# Altium schematic sheet Power.SchDoc: Linefollower-Power
size A3; Author: Patryk Bujak; DrawnBy: Patryk Bujak; DocumentNumber: 12; Revision: 1.0; SheetNumber: 10; SheetTotal: 10
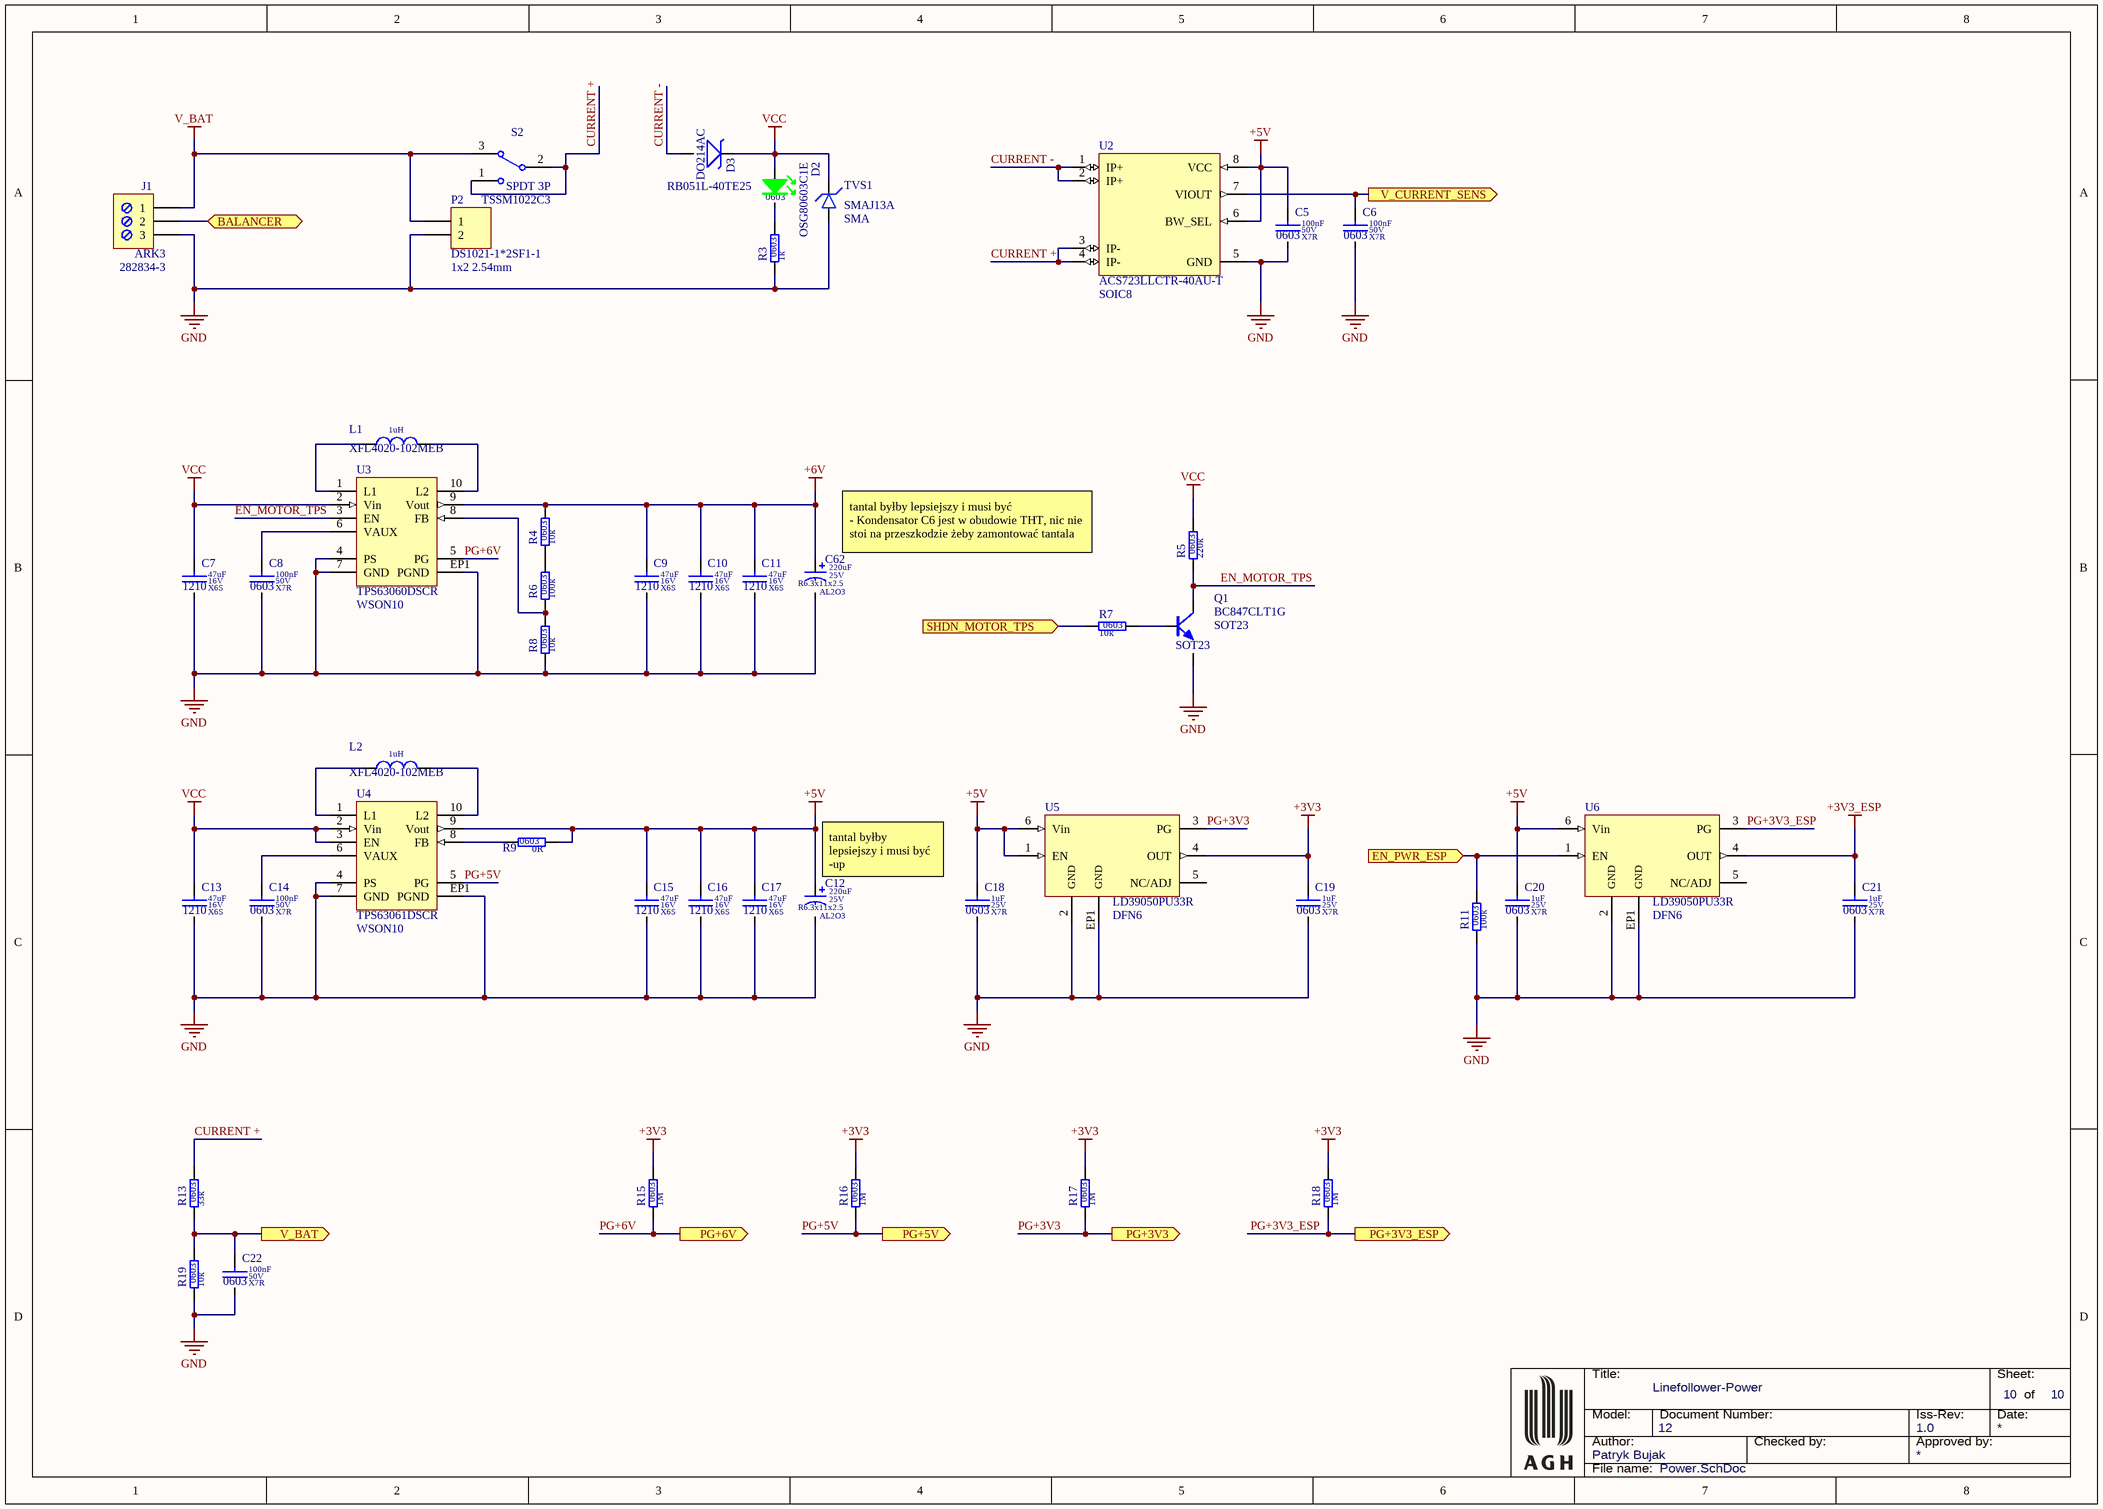
[diagram p0: Power.SchDoc]

## Parts
C5  value 100nF  Dielectric: X7R  Voltage: 50V  SCH_Footprint: 0603  [C_0603_1608]  (hidden comment: Ceramic X7R)
C6  value 100nF  Dielectric: X7R  Voltage: 50V  SCH_Footprint: 0603  [C_0603_1608]  (hidden comment: Ceramic X7R)
C7  value 47uF  Dielectric: X6S  Voltage: 16V  SCH_Footprint: 1210  [C_1210_3225]  (hidden comment: Ceramic X6S)
C8  value 100nF  Dielectric: X7R  Voltage: 50V  SCH_Footprint: 0603  [C_0603_1608]  (hidden comment: Ceramic X7R)
C9  value 47uF  Dielectric: X6S  Voltage: 16V  SCH_Footprint: 1210  [C_1210_3225]  (hidden comment: Ceramic X6S)
C10  value 47uF  Dielectric: X6S  Voltage: 16V  SCH_Footprint: 1210  [C_1210_3225]  (hidden comment: Ceramic X6S)
C11  value 47uF  Dielectric: X6S  Voltage: 16V  SCH_Footprint: 1210  [C_1210_3225]  (hidden comment: Ceramic X6S)
C12  value 220uF  Dielectric: AL2O3  SCH_Footprint: R6.3x11x2.5  Voltage: 25V  [C_R6.3x11x2.5]  (hidden comment: Electrolytic Capacitor)
C13  value 47uF  Dielectric: X6S  Voltage: 16V  SCH_Footprint: 1210  [C_1210_3225]  (hidden comment: Ceramic X6S)
C14  value 100nF  Dielectric: X7R  Voltage: 50V  SCH_Footprint: 0603  [C_0603_1608]  (hidden comment: Ceramic X7R)
C15  value 47uF  Dielectric: X6S  Voltage: 16V  SCH_Footprint: 1210  [C_1210_3225]  (hidden comment: Ceramic X6S)
C16  value 47uF  Dielectric: X6S  Voltage: 16V  SCH_Footprint: 1210  [C_1210_3225]  (hidden comment: Ceramic X6S)
C17  value 47uF  Dielectric: X6S  Voltage: 16V  SCH_Footprint: 1210  [C_1210_3225]  (hidden comment: Ceramic X6S)
C18  value 1uF  Dielectric: X7R  Voltage: 25V  SCH_Footprint: 0603  [C_0603_1608]  (hidden comment: Ceramic X7R)
C19  value 1uF  Dielectric: X7R  Voltage: 25V  SCH_Footprint: 0603  [C_0603_1608]  (hidden comment: Ceramic X7R)
C20  value 1uF  Dielectric: X7R  Voltage: 25V  SCH_Footprint: 0603  [C_0603_1608]  (hidden comment: Ceramic X7R)
C21  value 1uF  Dielectric: X7R  Voltage: 25V  SCH_Footprint: 0603  [C_0603_1608]  (hidden comment: Ceramic X7R)
C22  value 100nF  Dielectric: X7R  Voltage: 50V  SCH_Footprint: 0603  [C_0603_1608]  (hidden comment: Ceramic X7R)
C62  value 220uF  Dielectric: AL2O3  SCH_Footprint: R6.3x11x2.5  Voltage: 25V  [C_R6.3x11x2.5]  (hidden comment: Electrolytic Capacitor)
D2  value OSG80603C1E  SCH_Footprint: 0603  [OL_0603_1608]  (hidden comment: Green led)
D3  SCH_Footprint: DO214AC  [SMA_DO-214AC]  (hidden comment: RB051L-40TE25)
J1  value 282834-3  [J_ARK3_2.54]  (hidden comment: ARK3)
L1  value 1uH  SCH_Footprint: XFL4020-102MEB  [XFL4020]  (hidden comment: Inductor)
L2  value 1uH  SCH_Footprint: XFL4020-102MEB  [XFL4020]  (hidden comment: Inductor)
P2  value DS1021-1*2SF1-1  SCH_Footprint: 1x2 2.54mm  [P_HEADER_1x2_2.54]  (hidden comment: Goldpin)
Q1  value BC847CLT1G  SCH_Footprint: SOT23  [SOT23_TO236_SC59]  (hidden comment: BC847C)
R3  value 1k  SCH_Footprint: 0603  [R_0603_1608]  (hidden comment: Resistor)
R4  value 10k  SCH_Footprint: 0603  [R_0603_1608]  (hidden comment: Resistor)
R5  value 220k  SCH_Footprint: 0603  [R_0603_1608]  (hidden comment: Resistor)
R6  value 100k  SCH_Footprint: 0603  [R_0603_1608]  (hidden comment: Resistor)
R7  value 10k  SCH_Footprint: 0603  [R_0603_1608]  (hidden comment: Resistor)
R8  value 10k  SCH_Footprint: 0603  [R_0603_1608]  (hidden comment: Resistor)
R9  value 0R  SCH_Footprint: 0603  [R_0603_1608]  (hidden comment: Resistor)
R11  value 100k  SCH_Footprint: 0603  [R_0603_1608]  (hidden comment: Resistor)
R13  value 33k  SCH_Footprint: 0603  [R_0603_1608]  (hidden comment: Resistor)
R15  value 1M  SCH_Footprint: 0603  [R_0603_1608]  (hidden comment: Resistor)
R16  value 1M  SCH_Footprint: 0603  [R_0603_1608]  (hidden comment: Resistor)
R17  value 1M  SCH_Footprint: 0603  [R_0603_1608]  (hidden comment: Resistor)
R18  value 1M  SCH_Footprint: 0603  [R_0603_1608]  (hidden comment: Resistor)
R19  value 10k  SCH_Footprint: 0603  [R_0603_1608]  (hidden comment: Resistor)
S2  value TSSM1022C3  SCH_Footprint: SPDT 3P  [SPDT_3P]  (hidden comment: ON-ON Subminiature Toggle Switch, Right Angle Mounting, Vertical Actuation)
TVS1  value SMAJ13A  SCH_Footprint: SMA  [SMA_DO-214AC]  (hidden comment: TVS Unidirectional)
U2  value ACS723LLCTR-40AU-T  SCH_Footprint: SOIC8  [SOP8_SO8_SOIC8_4X5X18]  (hidden comment: Hall unidirectional current sensor)
U3  value TPS63060DSCR  SCH_Footprint: WSON10  [WSON10_3x3]  (hidden comment: TPS63060)
U4  value TPS63061DSCR  SCH_Footprint: WSON10  [WSON10_3x3]  (hidden comment: TPS63061)
U5  SCH_Footprint: DFN6  [DFN6_3x3]  (hidden comment: LD39050PU33R)
U6  SCH_Footprint: DFN6  [DFN6_3x3]  (hidden comment: LD39050PU33R)

## Ports
BALANCER (bidir), EN_PWR_ESP (in), PG+3V3 (out), PG+3V3_ESP (out), PG+5V (out), PG+6V (out), SHDN_MOTOR_TPS (in), V_BAT (out), V_CURRENT_SENS (out)

## Nets
+3V3: C19.1 R15.2 R16.2 R17.2 R18.2 U5.4(OUT)
+3V3_ESP: C21.1 U6.4(OUT)
+5V: C5.1 C12.1 C15.1 C16.1 C17.1 C18.1 C20.1 R9.1 U2.6(BW_SEL) U2.8(VCC) U4.9(Vout) U5.1(EN) U5.6(Vin) U6.6(Vin)
+6V: C9.1 C10.1 C11.1 C62.1 R4.2 U3.9(Vout)
GND: C5.2 C6.2 C7.2 C8.2 C9.2 C10.2 C11.2 C12.2 C13.2 C14.2 C15.2 C16.2 C17.2 C18.2 C19.2 C20.2 C21.2 C22.2 C62.2 J1.3 P2.2 Q1.2(E) R3.1 R8.1 R11.1 R19.1 TVS1.2 U2.5(GND) U3.4(PS) U3.7(GND) U3.EP1(PGND) U4.4(PS) U4.7(GND) U4.EP1(PGND) U5.2(GND) U5.EP1(GND) U6.2(GND) U6.EP1(GND)
V_BAT: J1.1 P2.1 S2.3
VCC: C7.1 C13.1 D2.2(A) D3.1 R5.2 TVS1.1 U3.2(Vin) U4.2(Vin) U4.3(EN)
BALANCER: J1.2 ; port BALANCER
CURRENT +: R13.2 S2.1 S2.2 U2.3(IP-) U2.4(IP-)
CURRENT -: D3.2 U2.1(IP+) U2.2(IP+)
EN_MOTOR_TPS: Q1.3(C) R5.1 U3.3(EN)
EN_PWR_ESP: R11.2 U6.1(EN) ; port EN_PWR_ESP
PG+3V3: R17.1 U5.3(PG) ; port PG+3V3
PG+3V3_ESP: R18.1 U6.3(PG) ; port PG+3V3_ESP
PG+5V: R16.1 U4.5(PG) ; port PG+5V
PG+6V: R15.1 U3.5(PG) ; port PG+6V
SHDN_MOTOR_TPS: R7.1 ; port SHDN_MOTOR_TPS
V_BAT: C22.1 R13.1 R19.2 ; port V_BAT  [a separate net that carries the same name]
V_CURRENT_SENS: C6.1 U2.7(VIOUT) ; port V_CURRENT_SENS
NetC8_1: C8.1 U3.6(VAUX)
NetC14_1: C14.1 U4.6(VAUX)
NetD2_1: D2.1(K) R3.2
NetL1_1: L1.1 U3.1(L1)
NetL1_2: L1.2 U3.10(L2)
NetL2_1: L2.1 U4.1(L1)
NetL2_2: L2.2 U4.10(L2)
NetQ1_1: Q1.1(B) R7.2
NetR4_1: R4.1 R6.2
NetR6_1: R6.1 R8.2 U3.8(FB)
NetR9_2: R9.2 U4.8(FB)

Not connected (* = marked no-connect by the designer): U5 5(NC/ADJ); U6 5(NC/ADJ)

## Notes on the sheet
- (near C62) tantal byłby lepsiejszy i musi być
  - Kondensator C6 jest w obudowie THT, nic nie stoi na przeszkodzie żeby zamontować tantala
- (near C12) tantal byłby lepsiejszy i musi być
  -up
- Title:
- Sheet:
- of
- Author:
- Model:
- Document Number:
- Checked by:
- Iss-Rev:
- Approved by:
- Date:
- File name:

## Library data of the parts
C5 C6 C8 C14 C22 = C_100nF_50V_X7R_0603_5: Capacitor; Manufacturer: Samsung; Manufacturer Part Number: CL10B104JB8NNNC; Tolerance (%): 5; Part Number: C_100nF_50V_X7R_0603_5; HelpURL: http://www.tme.eu/pl/Document/4a42202b32dab16128fe107dd69598cc/samsung-chip-cap.pdf; Supplier 1: TME; Supplier Part Number 1: CL10B104JB8NNNC; Supplier 2: RS Components; Supplier 3: Farnell; Supplier 4: Mouser; Supplier 5: Digi-Key
C7 C9-C11 C13 C15-C17 = C_47uF_16V_X6S_1210_10: Capacitor; Manufacturer: Murata; Manufacturer Part Number: GRM32EC81C476KE15L; Tolerance (%): 10; Part Number: C_47uF_16V_X6S_1210_10; HelpURL: https://datasheet.octopart.com/GRM32EC81C476KE15L-Murata-datasheet-138746852.pdf; Supplier 1: TME; Supplier 2: RS Components; Supplier Part Number 2: 8467369; Supplier 3: Farnell; Supplier Part Number 3: 1907527; Supplier 4: Mouser; Supplier Part Number 4: 81-GRM32EC81C476KE5L; Supplier 5: Digi-Key; Supplier Part Number 5: 490-10531-1-ND
C12 C62 = CE_220uF_25V_6.3x11x2.5_LESR_20: Polarized Capacitor; Manufacturer: Samxon; Manufacturer Part Number: GF 220U/25V; Tolerance (%): 20; Part Number: CE_220uF_25V_6.3x11x2.5_LESR_20; HelpURL: http://www.tme.eu/pl/Document/9fe41abe6e7b7973ea4089f212d099cc/E-GF_series.pdf; Supplier 1: TME; Supplier Part Number 1: GF220/25; Supplier 2: RS Components; Supplier 3: Farnell; Supplier 4: Mouser; Supplier 5: Digi-Key
C18-C21 = C_1uF_25V_X7R_0603_10: Capacitor; Manufacturer: Samsung; Manufacturer Part Number: CL10B105KA8NNNC; Tolerance (%): 10; Part Number: C_1uF_25V_X7R_0603_10; HelpURL: http://www.tme.eu/pl/Document/4a42202b32dab16128fe107dd69598cc/samsung-chip-cap.pdf; Supplier 1: TME; Supplier Part Number 1: CL10B105KA8NNNC; Supplier 2: RS Components; Supplier 3: Farnell; Supplier 4: Mouser; Supplier 5: Digi-Key
D2 = OL_G_0603_OSG80603C1E: LED GREEN; Manufacturer: Optosupply; Part Number: OL_G_0603_OSG80603C1E; Manufacturer Part Number: OSG80603C1E; Supplier 1: TME; Supplier Part Number 1: OSG80603C1E; Supplier 2: RS Components; Supplier 3: Farnell; Supplier 4: Mouser; Supplier 5: Digi-Key
D3 = DS_RB051L-40TE25_3A_20V_SMA: Manufacturer: Rohm; Current: 3A; Value: RB051L-40TE25; Part Number: DS_RB051L-40TE25_3A_20V_SMA; HelpURL: https://www.tme.eu/Document/ad2965130a92e364f1d92d949ed8cf88/RB051L-40TE25.pdf; Manufacturer Part Number: RB051L-40TE25; Supplier 1: TME; Supplier Part Number 1: RB051L-40TE25; Supplier 2: RS Components; Supplier Part Number 2: 2636897P; Supplier 3: Farnell; Supplier Part Number 3: 1680016; Supplier 4: Mouser; Supplier 5: Digi-Key; Supplier Part Number 5: RB051L-40TE25TR-ND
J1 = J_282834-3: ARK Screw terminal, 3-Pin; Manufacturer: TE Connectivity; SCH_Footprint: ARK3; Part Number: J_282834-3; Component Type: Standard; HelpURL: https://www.te.com/commerce/DocumentDelivery/DDEController?Action=showdoc&DocId=Catalog+Section%7F1308389_EUROSTYLE_TERMINAL_BLOCKS%7F0607%7Fpdf%7FEnglish%7FENG_CS_1308389_EUROSTYLE_TERMINAL_BLOCKS_0607.pdf%7F282834-3; Manufacturer Part Number: 282834-3; Supplier 1: TME; Supplier Part Number 1: 282834-3; Supplier 2: RS Components; Supplier Part Number 2: 717-6634; Supplier 3: Farnell; Supplier Part Number 3: 2396254; Supplier 4: Mouser; Supplier Part Number 4: 571-2828343; Supplier 5: Digi-Key; Supplier Part Number 5: A98334-ND
L1 L2 = LM_1uH_11A_XFL4020-102MEB: Induction; Manufacturer: Coilcraft; Current: 11A; Resistance: 11.9mR; Part Number: LM_1uH_11A_XFL4020-102MEB; HelpURL: https://datasheet.octopart.com/XFL4020-102MEB-Coilcraft-datasheet-10792328.pdf; Manufacturer Part Number: XFL4020-102MEB; Supplier 1: TME; Supplier 2: RS Components; Supplier 3: Farnell; Supplier 4: Mouser; Supplier Part Number 4: 994-XFL4020-102MEB; Supplier 5: Digi-Key; Supplier 6: Coilcfrat; Supplier Part Number 6: XFL4020-102MEB
P2 = P_HEADER_1x2_2.54: Header, 2-Pin; Manufacturer: Connfly; Part Number: P_HEADER_1x2_2.54; Component Type: Standard; HelpURL: http://www.tme.eu/en/Document/cc301e58a5da78cb543a94b5a5b7f06a/DS1021.pdf; Manufacturer Part Number: DS1021-1*2SF1-1; Supplier 1: TME; Supplier Part Number 1: ZL201-02G; Supplier 2: RS Components; Supplier 3: Farnell; Supplier 4: Mouser; Supplier 5: Digi-Key
Q1 = QNP_BC847C_45V_0A1: Manufacturer: ON Semiconductor; Type: NPN; Voltage: 45V; Current: 0A1; Part Number: QNP_BC847C_45V_0A1; HelpURL: https://assets.nexperia.com/documents/data-sheet/BC847_SER.pdf; Manufacturer Part Number: BC847CLT1G; Supplier 1: TME; Supplier Part Number 1: BC847CLT1G; Supplier 2: RS Components; Supplier 3: Farnell; Supplier 4: Mouser; Supplier 5: Digi-Key; Supplier Part Number 5: BC847CLT1GOSCT-ND
R3 = R_1k_0603_1: Manufacturer: Vishay; Manufacturer Part Number: CRCW06031K00FKEA; Voltage: 75V; Power: 100mW; Tolerance: 1%; Part Number: R_1k_0603_1; HelpURL: http://www.farnell.com/datasheets/2310790.pdf?_ga=2.256888843.1690599162.1548417389-1379097396.1542296996&_gac=1.262631934.1547230258.Cj0KCQiAmuHhBRD0ARIsAFWyPwhX8HcvXnM3tA0ZBodZLzDIjH2ZxLpjT5LWo9bad_HPRbU8LfPq44UaAhEwEALw_wcB; Supplier 1: TME; Supplier 2: RS Components; Supplier Part Number 2: 678-9875P; Supplier 3: Farnell; Supplier Part Number 3: 1469740; Supplier 4: Mouser; Supplier Part Number 4: 71-CRCW0603-1.0K-E3; Supplier 5: Digi-Key; Supplier Part Number 5: 541-1.00KHCT-ND
R4 R7 R8 R19 = R_10k_0603_1: Manufacturer: Vishay; Manufacturer Part Number: CRCW060310K0FKTABC; Voltage: 75V; Power: 100mW; Tolerance: 1%; Part Number: R_10k_0603_1; HelpURL: http://www.tme.eu/pl/Document/622e28308c06d160637f2b14751ba16b/Data%20Sheet%20CRCW_BCe3.pdf; Supplier 1: TME; Supplier Part Number 1: CRCW060310K0FKTABC; Supplier 2: RS Components; Supplier 3: Farnell; Supplier 4: Mouser; Supplier Part Number 4: 667-ERJ-3EKF1002V; Supplier 5: Digi-Key; Supplier Part Number 5: P10KGCT-ND
R5 = R_220k_0603_1: Manufacturer: Vishay; Manufacturer Part Number: CRCW0603220KFKTABC; Voltage: 75V; Power: 100mW; Tolerance: 1%; Part Number: R_220k_0603_1; HelpURL: https://www.tme.eu/Document/622e28308c06d160637f2b14751ba16b/Data%20Sheet%20CRCW_BCe3.pdf; Supplier 1: TME; Supplier Part Number 1: CRCW0603220KFKTABC; Supplier 2: RS Components; Supplier 3: Farnell; Supplier 4: Mouser; Supplier 5: Digi-Key
R6 R11 = R_100k_0603_1: Manufacturer: Royalohm; Manufacturer Part Number: 0603SAF1003T5E; Voltage: 50V; Power: 100mW; Tolerance: 1%; Part Number: R_100k_0603_1; HelpURL: http://www.tme.eu/pl/Document/b315665a56acbc42df513c99b390ad98/ROYALOHM-THICKFILM.pdf; Supplier 1: TME; Supplier Part Number 1: SMD0603-100K-1%; Supplier 2: RS Components; Supplier 3: Farnell; Supplier 4: Mouser; Supplier Part Number 4: 667-ERJ-3EKF1003V; Supplier 5: Digi-Key; Supplier Part Number 5: P100KHCT-ND
R9 = R_0R_0603_5: Manufacturer: Samsung; Manufacturer Part Number: RC1608J000CS; Voltage: 50V; Power: 100mW; Tolerance: 5%; Part Number: R_0R_0603_5; HelpURL: http://www.samsungsem.com/kr/support/product-search/chip-resistor/RC1608J000CS.jsp; Supplier 1: TME; Supplier 2: RS Components; Supplier 3: Farnell; Supplier 4: Mouser; Supplier 5: Digi-Key; Supplier Part Number 5: 1276-3510-1-ND
R13 = R_33k_0603_1: Manufacturer: Vishay; Manufacturer Part Number: CRCW060333K0FKTABC; Voltage: 75V; Power: 100mW; Tolerance: 1%; Part Number: R_33k_0603_1; HelpURL: http://www.tme.eu/pl/Document/622e28308c06d160637f2b14751ba16b/Data%20Sheet%20CRCW_BCe3.pdf; Supplier 1: TME; Supplier Part Number 1: CRCW060333K0FKTABC; Supplier 2: RS Components; Supplier 3: Farnell; Supplier 4: Mouser; Supplier Part Number 4: 71-CRCW0603-33K; Supplier 5: Digi-Key
R15-R18 = R_1M_0603_1: Manufacturer: Bourns; Manufacturer Part Number: CR0603-FX-1004ELF; Voltage: 50V; Power: 100mW; Tolerance: 1%; Part Number: R_1M_0603_1; HelpURL: https://datasheet.octopart.com/CR0603-FX-1004ELF-Bourns-datasheet-5318152.pdf; Supplier 1: TME; Supplier 2: RS Components; Supplier 3: Farnell; Supplier Part Number 3: 2321755; Supplier 4: Mouser; Supplier Part Number 4: 652-CR0603FX-1004ELF; Supplier 5: Digi-Key; Supplier Part Number 5: CR0603-FX-1004ELFCT-ND
S2 = S_TSSM1022C3: Manufacturer: Ninigi; Part Number: S_TSSM1022C3; HelpURL: https://www.tme.eu/Document/30b7e6362e90fef2b4472b38492345f6/tssm102.pdf; Manufacturer Part Number: TSSM1022C3; Supplier 1: TME; Supplier Part Number 1: TSSM1022C3; Supplier 2: RS Components; Supplier 3: Farnell; Supplier 4: Mouser; Supplier 5: Digi-Key
TVS1 = TVS_SMAJ13A: Manufacturer: Littelfuse; Voltage: 15.15V; Current: 18.6A; Part Number: TVS_SMAJ13A; HelpURL: https://www.tme.eu/Document/dbc72d81c249fe51b6ab42300e8e06d0/SMAJ_ser.pdf; Manufacturer Part Number: SMAJ13A; Supplier 1: TME; Supplier Part Number 1: SMAJ13A-LF; Supplier 2: RS Components; Supplier 3: Farnell; Supplier Part Number 3: 2762813; Supplier 4: Mouser; Supplier Part Number 4: 576-SMAJ13A; Supplier 5: Digi-Key; Supplier Part Number 5: SMAJ13ALFCT-ND
U2 = U_ACS723LLCTR-40AU-T: Manufacturer: Allegro; Part Number: U_ACS723LLCTR-40AU-T; HelpURL: https://www.allegromicro.com/~/media/Files/Datasheets/ACS723-Datasheet.ashx?la=en&hash=1800BF05ABE975CB295D729784D3AEABF820A0DC; Manufacturer Part Number: ACS723LLCTR-40AU-T; Supplier 1: TME; Supplier 2: RS Components; Supplier 3: Farnell; Supplier 4: Mouser; Supplier 5: Digi-Key; Supplier Part Number 5: 620-1647-1-ND
U3 = VS_TPS63060DSC: Manufacturer: Texas Instruments; Frequency (kHz): 2400; Topology: Buck-Boost; Vin min (V): 2,5; Vin max (V): 12; Vout max (V): 8; Imax (A): 2; Iswitch (A): 0; Part Number: VS_TPS63060DSC; Vout min (V): 2,5; HelpURL: http://www.ti.com/lit/ds/symlink/tps63061.pdf; Manufacturer Part Number: TPS63060DSCR; Supplier 1: TME; Supplier 2: RS Components; Supplier 3: Farnell; Supplier Part Number 3: 2459493; Supplier 4: Mouser; Supplier Part Number 4: 595-TPS63060DSCR; Supplier 5: Digi-Key; Supplier Part Number 5: 296-30204-1-ND
U4 = VS_TPS63061DSC: Manufacturer: Texas Instruments; Frequency (kHz): 2400; Topology: Buck-Boost; Vin min (V): 2,5; Vin max (V): 12; Vout max (V): 8; Imax (A): 2; Iswitch (A): 0; Part Number: VS_TPS63061DSC; Vout min (V): 2,5; HelpURL: http://www.ti.com/lit/ds/symlink/tps63061.pdf; Manufacturer Part Number: TPS63061DSCR; Supplier 1: TME; Supplier 2: RS Components; Supplier Part Number 2: 121-9377; Supplier 3: Farnell; Supplier Part Number 3: 2082429; Supplier 4: Mouser; Supplier Part Number 4: 595-TPS63061DSCR; Supplier 5: Digi-Key; Supplier Part Number 5: 296-30205-1-ND
U5 U6 = VL_LD39050PU33R: Manufacturer: STMicroelectronics; Voltage: 3.3V; Current: 500mA; Value: LD39050PU33R; Part Number: VL_LD39050PU33R; HelpURL: https://www.tme.eu/pl/Document/062513da0f421ddb82a14a498f7bf1c8/LD39050.pdf; Manufacturer Part Number: LD39050PU33R; Supplier 1: TME; Supplier Part Number 1: LD39050PU33R; Supplier 2: RS Components; Supplier 3: Farnell; Supplier Part Number 3: 2762703; Supplier 4: Mouser; Supplier Part Number 4: 511-LD39050PU33R; Supplier 5: Digi-Key; Supplier Part Number 5: 497-8716-1-ND